# Altium project PCB_Project_Pult_Addon.PrjPcb
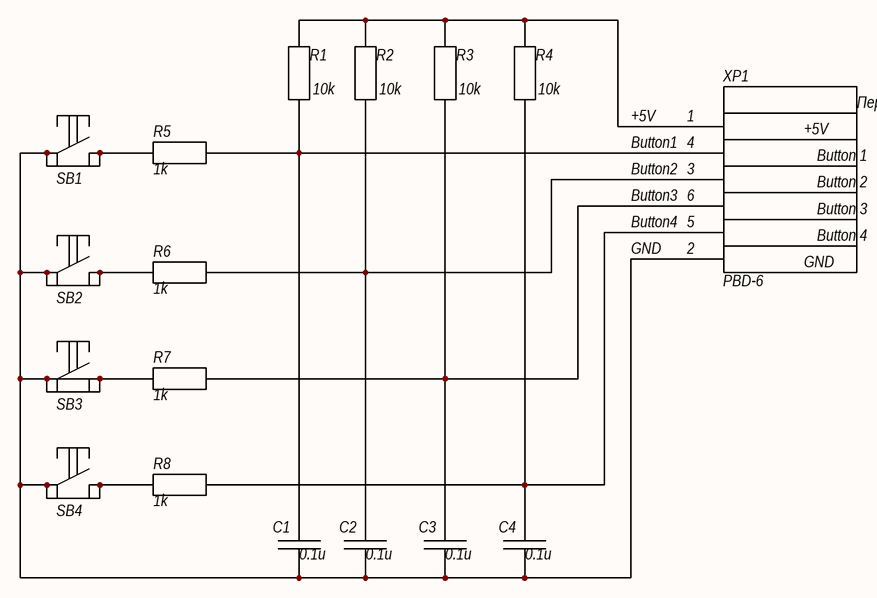
[diagram p0: Sheet1.SchDoc]
1 sheet, 17 parts. Net scope: global (net labels, ports and power ports of the same name join across sheets).
Board file: PCB1.PcbDoc

## Sheet Sheet1.SchDoc
size 420 x 297 mm; Address1: Address1; Address2: Address2; Address3: Address3; Address4: Address4; DocumentNumber: АБВГ.123456.001 Э3; SheetNumber: 1; Scale: 1:1; DocumentType: Схема электрическая принципиальная; FirstReferrence: АБВГ.123456.001

### Parts
C1  0.1u  [Cap 0805]
C2  0.1u  [Cap 0805]
C3  0.1u  [Cap 0805]
C4  0.1u  [Cap 0805]
R1  10k  [Res 0805]
R2  10k  [Res 0805]
R3  10k  [Res 0805]
R4  10k  [Res 0805]
R5  1k  [Res 0805]
R6  1k  [Res 0805]
R7  1k  [Res 0805]
R8  1k  [Res 0805]
SB1  Switch  [Switch Tact]  (value not drawn)
SB2  Switch  [Switch Tact]  (value not drawn)
SB3  Switch  [Switch Tact]  (value not drawn)
SB4  Switch  [Switch Tact]  (value not drawn)
XP1  PBD-6  [PBD-6]

### Nets
+5V: R1.2 R2.2 R3.2 R4.2 XP1.1
Button1: C1.1 R1.1 R5.2 XP1.4
Button2: C2.1 R2.1 R6.2 XP1.3
Button3: C3.1 R3.1 R7.2 XP1.6
Button4: C4.1 R4.1 R8.2 XP1.5
GND: C1.2 C2.2 C3.2 C4.2 R7.1 SB1.1 SB1.3 SB2.1 SB2.3 SB3.1 SB3.2 SB3.3 SB3.4 SB4.1 SB4.3 XP1.2
NetR5_1: R5.1 SB1.2 SB1.4
NetR6_1: R6.1 SB2.2 SB2.4
NetR8_1: R8.1 SB4.2 SB4.4

### Notes on the sheet
- Перв. примен.
- Справ. №
- Подп. и дата
- Инв. № дубл.
- Взам. инв. №
- Разраб.
- Изм.
- Лист
- № докум.
- Подп.
- Дата
- Лит.
- Масса
- Масштаб
- Пров.
- Т.контр.
- Листов
- Инв. № подл.
- Утв.
- Н.контр.
- 2.106-A3
- Копировал
- Формат А3
- (in symbol PBD-6) Переходной разъём; +5V; Button 1; Button 2; Button 3; Button 4; GND

### Library data of the parts
C1-C4 = Capacitor: Value: 0.1u
R1-R8 = Resistor: HelpURL: *; Manufacture: *
  R1-R4: Value: 10k
  R5-R8: Value: 1k
SB1-SB4 = Switch Tact